# Altium schematic sheet device-apps.SchDoc
size 297 x 209 mm
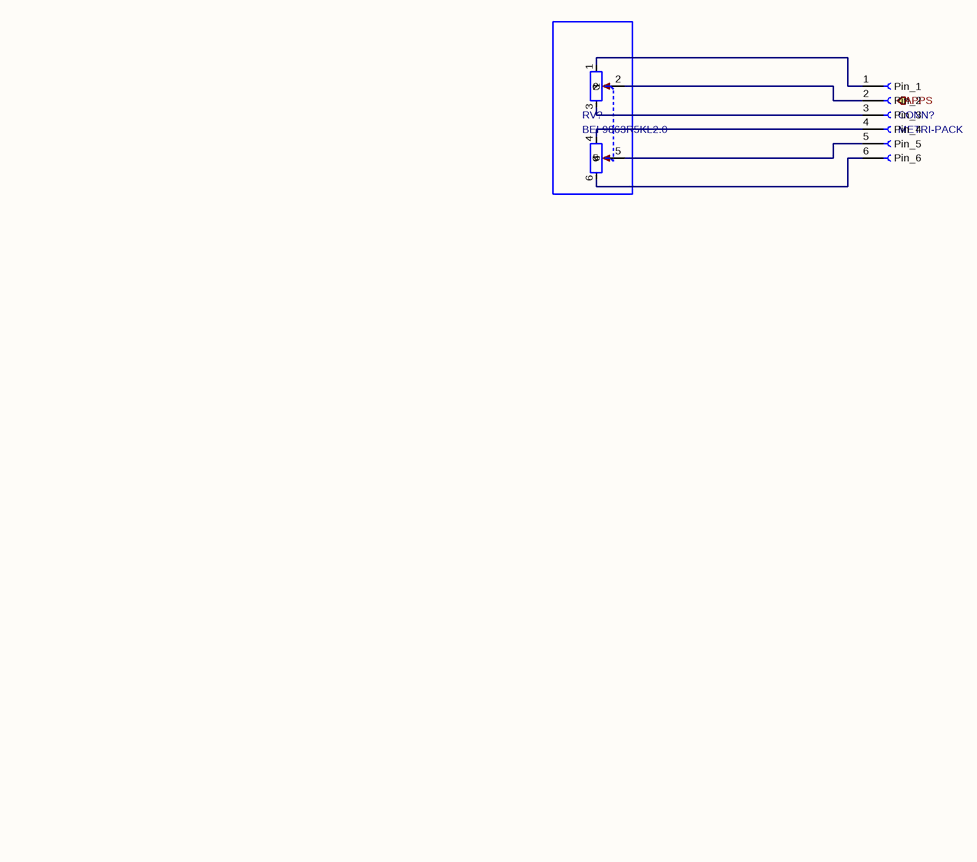
[diagram p0: device-apps.SchDoc]

## Parts
CONN?  METRI-PACK
RV?  BEI 9863R5KL2.0

## Ports
APPS (out)

## Nets
NetCONN?_1: CONN?.1(Pin_1) RV?.1
NetCONN?_2: CONN?.2(Pin_2) RV?.2
NetCONN?_3: CONN?.3(Pin_3) RV?.3
NetCONN?_4: CONN?.4(Pin_4) RV?.4
NetCONN?_5: CONN?.5(Pin_5) RV?.5
NetCONN?_6: CONN?.6(Pin_6) RV?.6

## Notes on the sheet
- 1
- 2
- 3
- 4
- 5
- 6
- A
- B
- C
- D
- Title: DEVICE - APPS
- File: device-apps.kicad_sch
- Sheet: /
- KiCad E.D.A.  kicad (5.1.4)-1
- Size: A4
- Date:
- Rev:
- Id: 1/1

## Library data of the parts
CONN? = Conn_01x06_Socket: Value: METRI-PACK
RV? = R_Potentiometer_Dual: Value: BEI 9863R5KL2.0